# EAGLE schematic zeta2rework_lw_v32_rework (EAGLE 9.3.1)
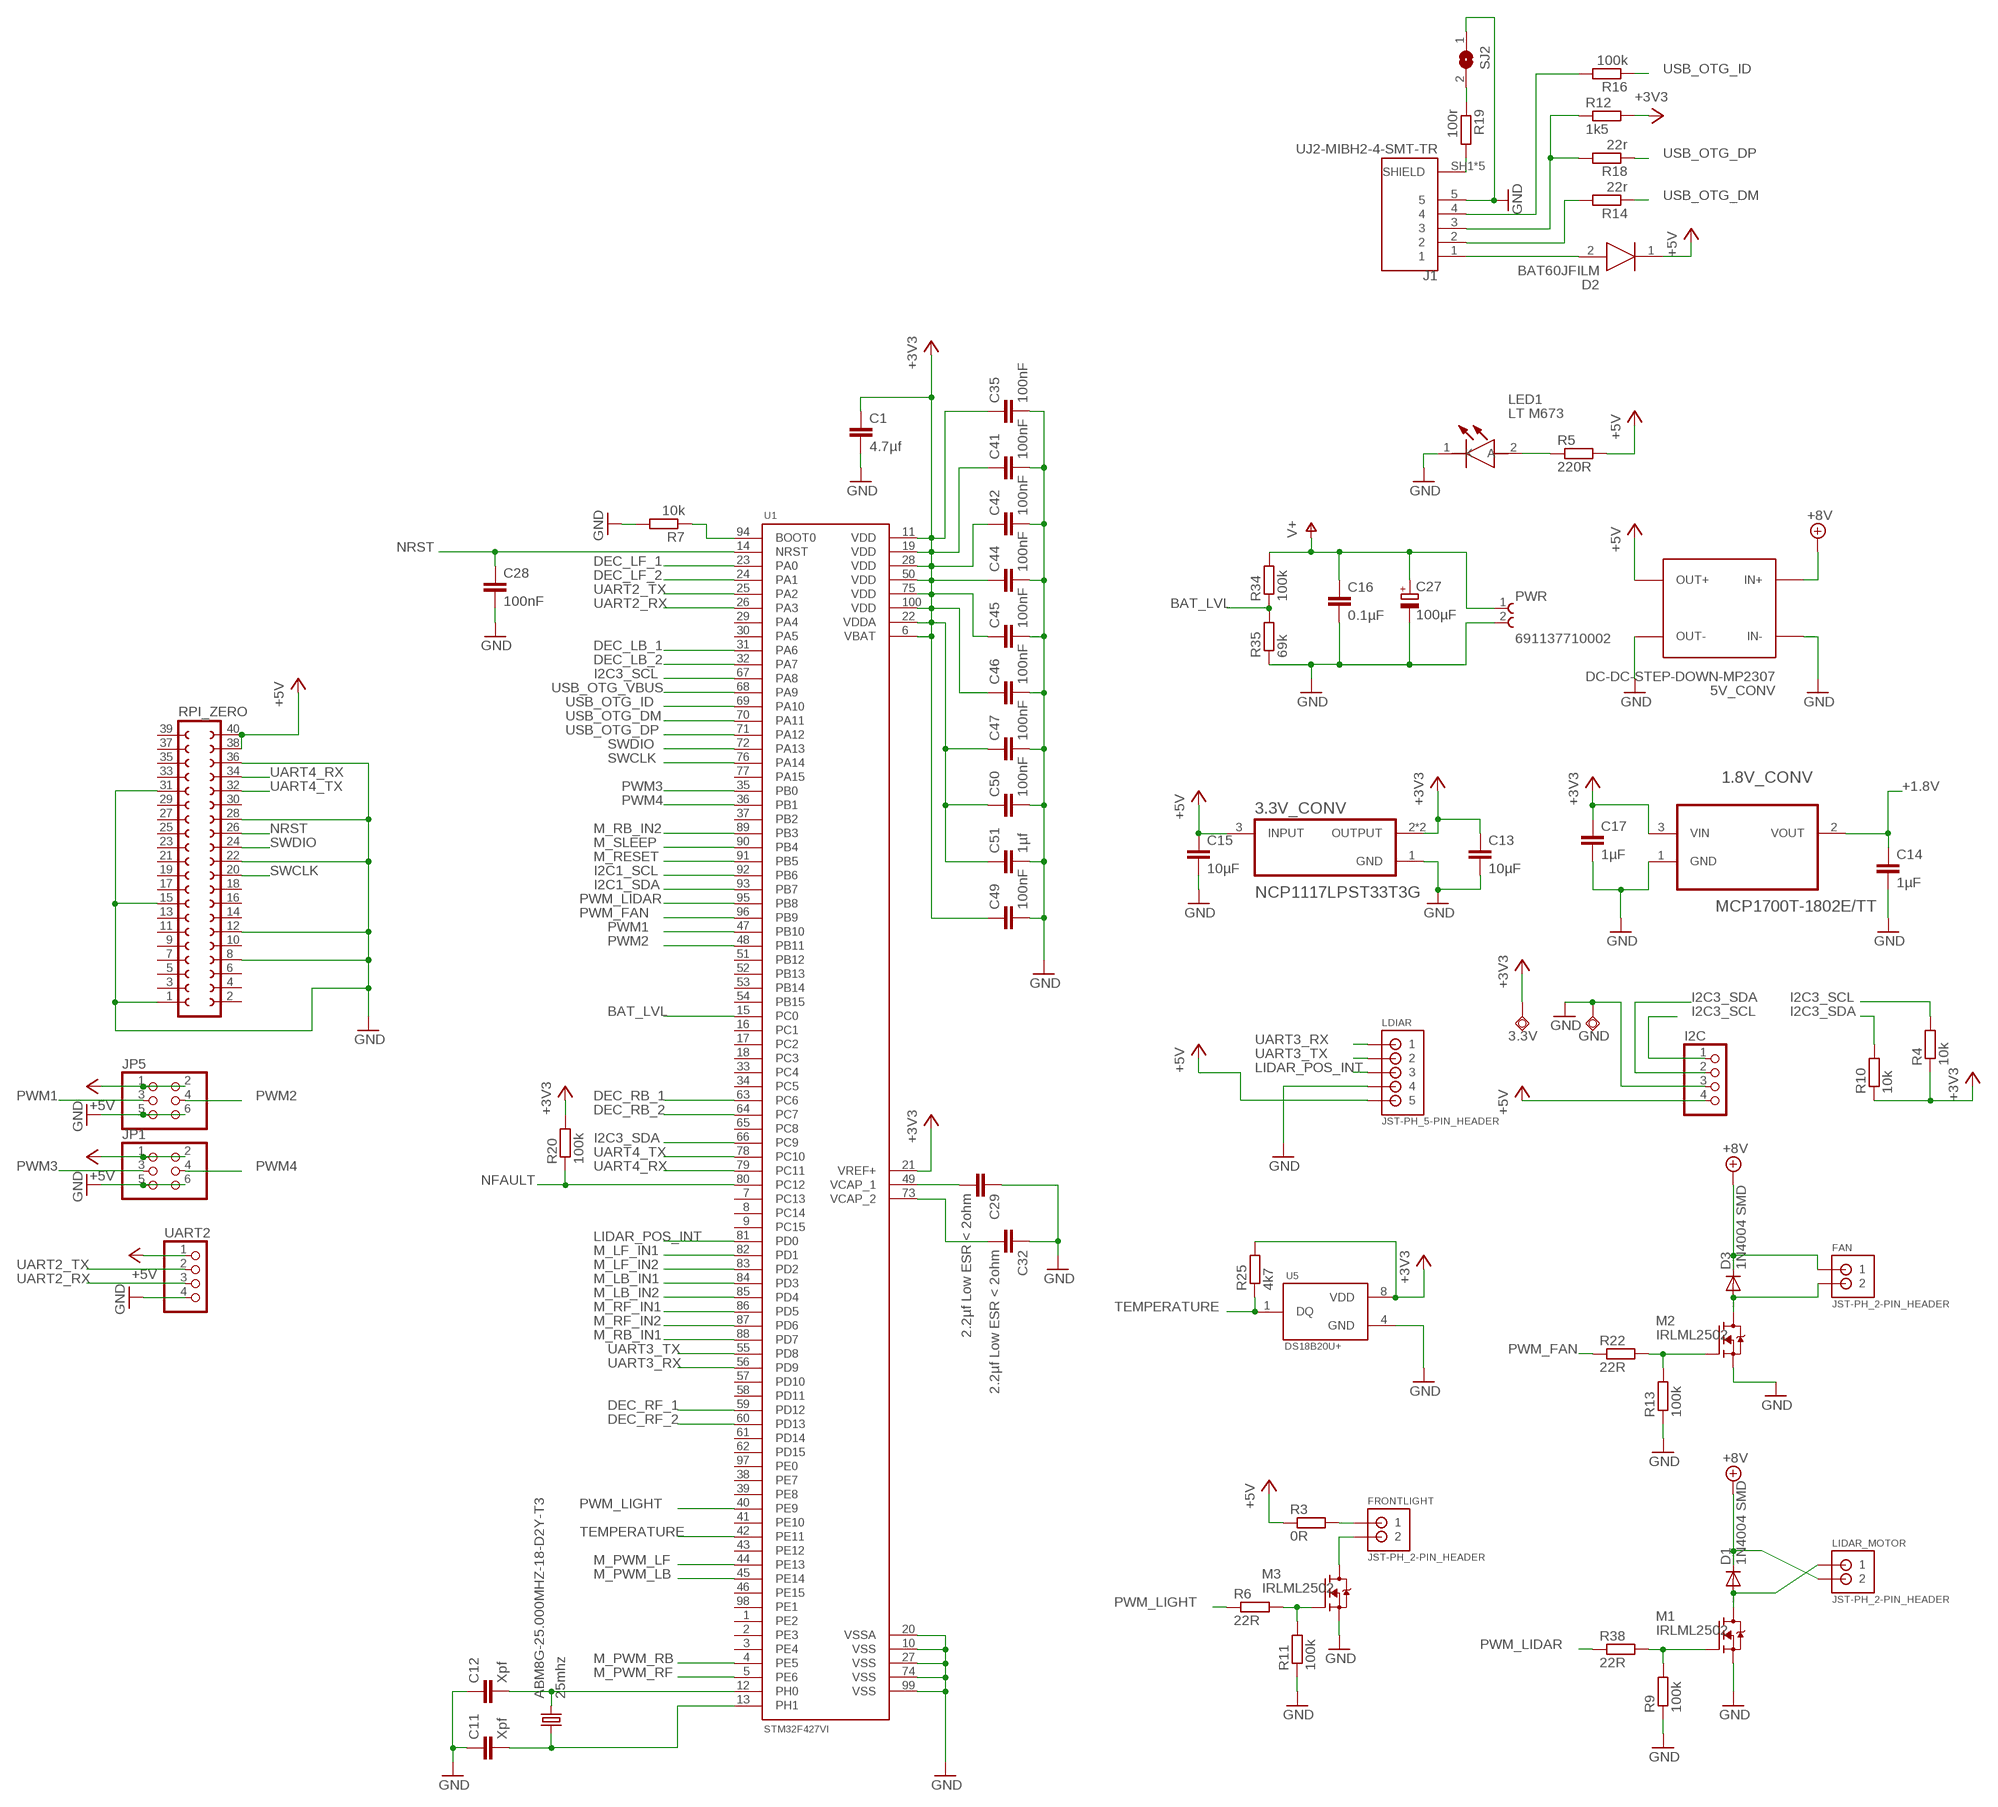
[diagram p0: schematic, sheet 1, part 1 of 2]
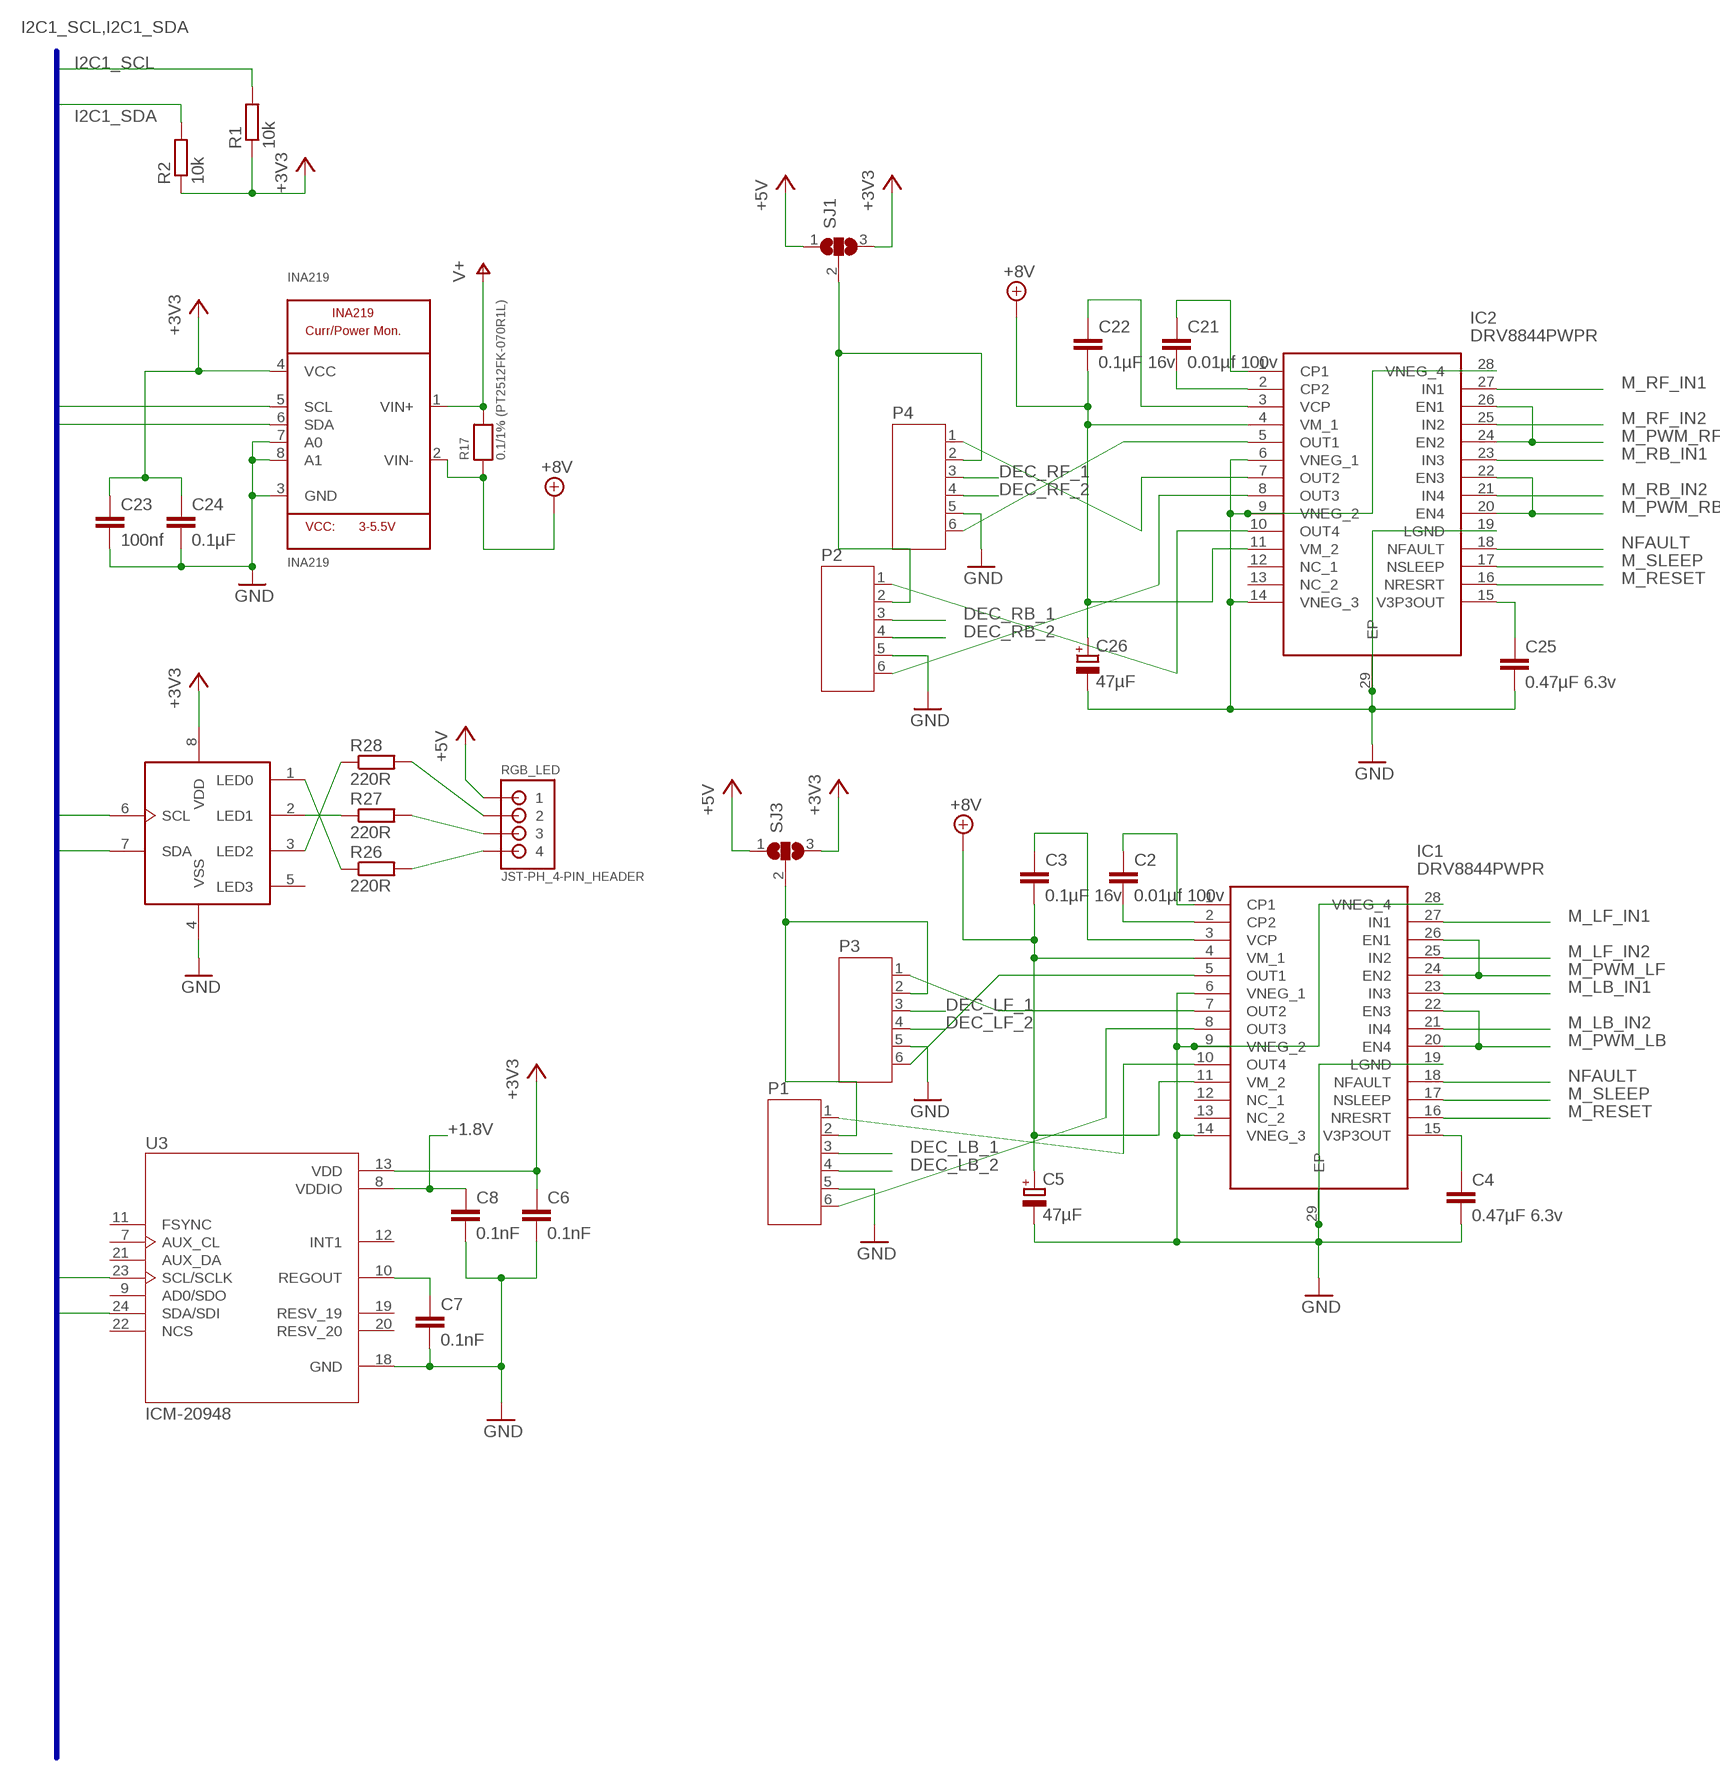
[diagram p1: schematic, sheet 1, part 2 of 2]

## Parts
1.8V_CONV  MCP1700T-1802E/TT  MCP1700T-2102E/TT  [SOT95P237X112-3N]
3.3V  TPSQTP20R  [TP20R]
3.3V_CONV  NCP1117LPST33T3G  [SOT230P700X175-4N]
5V_CONV  DC-DC-STEP-DOWN-MP2307  [DC-DC-STEP-DOWN-MP2307]
ABM8G-25.000MHZ-18-D2Y-T3  25mhz  KX-9A  [5.0X3.2_KX-9A]
C1  4.7µf  C-EUC0603  [C0603]
C2  0.01µf 100v  C-EUC0603  [C0603]
C3  0.1µF 16v  C-EUC0603  [C0603]
C4  0.47µF 6.3v  C-EUC0603  [C0603]
C5  47µF  CPOL-EUUD-5X5,8  [UD-5X5,8_NICHICON]
C6  0.1nF  C-EUC0603  [C0603]
C7  0.1nF  C-EUC0603  [C0603]
C8  0.1nF  C-EUC0603  [C0603]
C11  Xpf  C-EUC0603  [C0603]
C12  Xpf  C-EUC0603  [C0603]
C13  10µF  C-EUC1206  [C1206]
C14  1µF  C-EUC0603  [C0603]
C15  10µF  C-EUC1206  [C1206]
C16  0.1µF  C-EUC0603  [C0603]
C17  1µF  C-EUC0603  [C0603]
C21  0.01µf 100v  C-EUC0603  [C0603]
C22  0.1µF 16v  C-EUC0603  [C0603]
C23  100nf  C-EUC0603  [C0603]
C24  0.1µF  C-EUC0603  [C0603]
C25  0.47µF 6.3v  C-EUC0603  [C0603]
C26  47µF  CPOL-EUUD-5X5,8  [UD-5X5,8_NICHICON]
C27  100µF  CPOL-EUUD-5X5,8  [UD-5X5,8_NICHICON]
C28  100nF  C-EUC0603  [C0603]
C29  2.2µf Low ESR < 2ohm  C-EUC1206  [C1206]
C32  2.2µf Low ESR < 2ohm  C-EUC1206  [C1206]
C35  100nF  C-EUC0603  [C0603]
C41  100nF  C-EUC0603  [C0603]
C42  100nF  C-EUC0603  [C0603]
C44  100nF  C-EUC0603  [C0603]
C45  100nF  C-EUC0603  [C0603]
C46  100nF  C-EUC0603  [C0603]
C47  100nF  C-EUC0603  [C0603]
C49  100nF  C-EUC0603  [C0603]
C50  100nF  C-EUC0603  [C0603]
C51  1µf  C-EUC0603  [C0603]
D1  1N4004 SMD  DIODE-DO214AC  [DO214AC]
D2  BAT60JFILM  [SOD2513X117N]
D3  1N4004 SMD  DIODE-DO214AC  [DO214AC]
FAN  JST-PH_2-PIN_HEADER  [JST_B2B-PH_HEADER]
FRONTLIGHT  JST-PH_2-PIN_HEADER  [JST_B2B-PH_HEADER]
GND  TPSQTP20R  [TP20R]
I2C  PINHD-1X4  [1X04]
IC1  DRV8844PWPR  [SOP65P640X120-29N]
IC2  DRV8844PWPR  [SOP65P640X120-29N]
INA219  INA219  [SOT23-8]
J1  UJ2-MIBH2-4-SMT-TR  [CUI_UJ2-MIBH2-4-SMT-TR]
JP1  PINHD-2X3  [2X03]
JP5  PINHD-2X3  [2X03]
LDIAR  JST-PH_5-PIN_HEADER  [JST_B5B-PH_HEADER]
LED1  LT M673  LT_M673-N1R2-25  [LTM673-N1R2-25]
LIDAR_MOTOR  JST-PH_2-PIN_HEADER  [JST_B2B-PH_HEADER]
M1  IRLML2502  IRLML2502TRPBF  [SOT23]
M2  IRLML2502  IRLML2502TRPBF  [SOT23]
M3  IRLML2502  IRLML2502TRPBF  [SOT23]
P1  JST-PH6  [JST-PH6]
P2  JST-PH6  [JST-PH6]
P3  JST-PH6  [JST-PH6]
P4  JST-PH6  [JST-PH6]
PCA9533  PCA9533  [SOIC8]
PWR  691137710002  [691137710002]
R1  10k  R-EU_R0603  [R0603]
R2  10k  R-EU_R0603  [R0603]
R3  0R  R-EU_R0603  [R0603]
R4  10k  R-EU_R0603  [R0603]
R5  220R  R-EU_R0603  [R0603]
R6  22R  R-EU_R0603  [R0603]
R7  10k  R-EU_R0603  [R0603]
R9  100k  R-EU_R0603  [R0603]
R10  10k  R-EU_R0603  [R0603]
R11  100k  R-EU_R0603  [R0603]
R12  1k5  R-EU_R0603  [R0603]
R13  100k  R-EU_R0603  [R0603]
R14  22r  R-EU_R0603  [R0603]
R16  100k  R-EU_R0603  [R0603]
R17  0.1/1% (PT2512FK-070R1L)  RESISTOR2512  [2512]
R18  22r  R-EU_R0603  [R0603]
R19  100r  R-EU_R0603  [R0603]
R20  100k  R-EU_R0603  [R0603]
R22  22R  R-EU_R0603  [R0603]
R25  4k7  R-EU_R0603  [R0603]
R26  220R  R-EU_R0603  [R0603]
R27  220R  R-EU_R0603  [R0603]
R28  220R  R-EU_R0603  [R0603]
R34  100k  R-EU_R0603  [R0603]
R35  69k  R-EU_R0603  [R0603]
R38  22R  R-EU_R0603  [R0603]
RGB_LED  JST-PH_4-PIN_HEADER  [JST_B4B-PH_HEADER]
RPI_ZERO  FE20-2  [FE20-2]
SJ1  SJ2W  [SJ_2]
SJ2  SJ  [SJ]
SJ3  SJ2W  [SJ_2]
U1  STM32F427VI  STM32F427VGT7  [QFP50P1600X1600X160-100N]
U3  ICM-20948  [QFN40P300X300X105-25N]
U5  DS18B20U+  [SOP65P490X95-8N]
UART2  PINHD-1X4  [1X04]

## Nets
+1.8V: 1.8V_CONV.2(VOUT) C8.1 C14.1 U3.8(VDDIO)
+3V3: 1.8V_CONV.3(VIN) 3.3V.TP 3.3V_CONV.2(OUTPUT) 3.3V_CONV.4(OUTPUT) C1.1 C6.1 C13.1 C17.1 C23.1 C24.1 C35.1 C41.1 C42.1 C44.1 C45.1 C46.1 C47.1 C49.1 C50.1 C51.1 INA219.4(VCC) PCA9533.8(VDD) R1.1 R2.1 R4.1 R10.1 R12.2 R20.2 R25.2 SJ1.3 SJ3.3 U1.6(VBAT) U1.11(VDD) U1.19(VDD) U1.21(VREF+) U1.22(VDDA) U1.28(VDD) U1.50(VDD) U1.75(VDD) U1.100(VDD) U3.13(VDD) U5.8(VDD)
+5V: 3.3V_CONV.3(INPUT) 5V_CONV.OUT+ C15.1 D2.1(K) I2C.4 JP1.1 JP1.2 JP5.1 JP5.2 LDIAR.P5 R3.1 R5.2 RGB_LED.P1 RPI_ZERO.38 RPI_ZERO.40 SJ1.1 SJ3.1 UART2.1
+8V: 5V_CONV.IN+ C3.2 C5.+ C22.2 C26.+ D1.C D3.C FAN.P1 IC1.4(VM_1) IC1.11(VM_2) IC2.4(VM_1) IC2.11(VM_2) INA219.2(VIN-) LIDAR_MOTOR.P2 R17.1
BAT_LVL: R34.1 R35.2 U1.15(PC0)
DEC_LB_1: P1.3 U1.31(PA6)
DEC_LB_2: P1.4 U1.32(PA7)
DEC_LF_1: P3.3 U1.23(PA0)
DEC_LF_2: P3.4 U1.24(PA1)
DEC_RB_1: P2.3 U1.63(PC6)
DEC_RB_2: P2.4 U1.64(PC7)
DEC_RF_1: P4.3 U1.59(PD12)
DEC_RF_2: P4.4 U1.60(PD13)
GND: 1.8V_CONV.1(GND) 3.3V_CONV.1(GND) 5V_CONV.IN- 5V_CONV.OUT- C1.2 C4.2 C5.- C6.2 C7.2 C8.2 C11.1 C12.1 C13.2 C14.2 C15.2 C16.2 C17.2 C23.2 C24.2 C25.2 C26.- C27.- C28.2 C29.1 C32.1 C35.2 C41.2 C42.2 C44.2 C45.2 C46.2 C47.2 C49.2 C50.2 C51.2 GND.TP I2C.3 IC1.6(VNEG_1) IC1.9(VNEG_2) IC1.14(VNEG_3) IC1.19(LGND) IC1.28(VNEG_4) IC1.29(EP) IC2.6(VNEG_1) IC2.9(VNEG_2) IC2.14(VNEG_3) IC2.19(LGND) IC2.28(VNEG_4) IC2.29(EP) INA219.3(GND) INA219.7(A0) INA219.8(A1) J1.5 JP1.5 JP1.6 JP5.5 JP5.6 LDIAR.P4 LED1.1(K) M1.2(S) M2.2(S) M3.2(S) P1.5 P2.5 P3.5 P4.5 PCA9533.4(VSS) PWR.2 R7.2 R9.1 R11.1 R13.1 R35.1 RPI_ZERO.1 RPI_ZERO.8 RPI_ZERO.12 RPI_ZERO.15 RPI_ZERO.22 RPI_ZERO.28 RPI_ZERO.31 RPI_ZERO.36 SJ2.1 U1.10(VSS) U1.20(VSSA) U1.27(VSS) U1.74(VSS) U1.99(VSS) U3.18(GND) U5.4(GND) UART2.4
I2C1_SCL: INA219.5(SCL) PCA9533.6(SCL) R1.2 U1.92(PB6) U3.23(SCL/SCLK)
I2C1_SDA: INA219.6(SDA) PCA9533.7(SDA) R2.2 U1.93(PB7) U3.24(SDA/SDI)
I2C3_SCL: I2C.1 R4.2 U1.67(PA8)
I2C3_SDA: I2C.2 R10.2 U1.66(PC9)
LIDAR_POS_INT: LDIAR.P3 U1.81(PD0)
M_LB_IN1: IC1.23(IN3) U1.84(PD3)
M_LB_IN2: IC1.21(IN4) U1.85(PD4)
M_LF_IN1: IC1.27(IN1) U1.82(PD1)
M_LF_IN2: IC1.25(IN2) U1.83(PD2)
M_PWM_LB: IC1.20(EN4) IC1.22(EN3) U1.45(PE14)
M_PWM_LF: IC1.24(EN2) IC1.26(EN1) U1.44(PE13)
M_PWM_RB: IC2.20(EN4) IC2.22(EN3) U1.4(PE5)
M_PWM_RF: IC2.24(EN2) IC2.26(EN1) U1.5(PE6)
M_RB_IN1: IC2.23(IN3) U1.88(PD7)
M_RB_IN2: IC2.21(IN4) U1.89(PB3)
M_RESET: IC1.16(NRESRT) IC2.16(NRESRT) U1.91(PB5)
M_RF_IN1: IC2.27(IN1) U1.86(PD5)
M_RF_IN2: IC2.25(IN2) U1.87(PD6)
M_SLEEP: IC1.17(NSLEEP) IC2.17(NSLEEP) U1.90(PB4)
N$1: C21.2 IC2.2(CP2)
N$2: C21.1 IC2.1(CP1)
N$3: C22.1 IC2.3(VCP)
N$4: IC2.10(OUT4) P2.1
N$5: J1.3 R12.1 R18.2
N$6: FRONTLIGHT.P1 R3.2
N$7: LED1.2(A) R5.1
N$8: C7.1 U3.10(REGOUT)
N$9: FRONTLIGHT.P2 M3.3(D)
N$10: M3.1(G) R6.2 R11.2
N$11: IC2.5(OUT1) P4.6
N$12: IC2.7(OUT2) P4.1
N$13: ABM8G-25.000MHZ-18-D2Y-T3.1 C11.2 U1.13(PH1)
N$14: IC1.5(OUT1) P3.6
N$15: D2.2(A) J1.1
N$16: R7.1 U1.94(BOOT0)
N$17: J1.4 R16.2
N$18: C2.2 IC1.2(CP2)
N$19: IC2.8(OUT3) P2.6
N$20: C2.1 IC1.1(CP1)
N$21: C3.1 IC1.3(VCP)
N$22: PCA9533.1(LED0) R26.1
N$23: PCA9533.2(LED1) R27.1
N$24: PCA9533.3(LED2) R28.1
N$25: R19.1 SJ2.2
N$26: C25.1 IC2.15(V3P3OUT)
N$27: IC1.7(OUT2) P3.1
N$28: IC1.8(OUT3) P1.6
N$29: C4.1 IC1.15(V3P3OUT)
N$30: IC1.10(OUT4) P1.1
N$31: R26.2 RGB_LED.P4
N$32: P2.2 P4.2 SJ1.2
N$33: R27.2 RGB_LED.P3
N$34: J1.2 R14.2
N$35: R28.2 RGB_LED.P2
N$36: C29.2 U1.49(VCAP_1)
N$37: M2.1(G) R13.2 R22.2
N$38: M1.1(G) R9.2 R38.2
N$39: D1.A LIDAR_MOTOR.P1 M1.3(D)
N$40: J1.SH1(SHIELD) J1.SH2(SHIELD) J1.SH3(SHIELD) J1.SH4(SHIELD) J1.SH5(SHIELD) R19.2
N$41: P1.2 P3.2 SJ3.2
N$44: ABM8G-25.000MHZ-18-D2Y-T3.3 C12.2 U1.12(PH0)
N$45: C32.2 U1.73(VCAP_2)
N$55: D3.A FAN.P2 M2.3(D)
NFAULT: IC1.18(NFAULT) IC2.18(NFAULT) R20.1 U1.80(PC12)
NRST: C28.1 RPI_ZERO.26 U1.14(NRST)
PWM1: JP5.3 U1.47(PB10)
PWM2: JP5.4 U1.48(PB11)
PWM3: JP1.3 U1.35(PB0)
PWM4: JP1.4 U1.36(PB1)
PWM_FAN: R22.1 U1.96(PB9)
PWM_LIDAR: R38.1 U1.95(PB8)
PWM_LIGHT: R6.1 U1.40(PE9)
SWCLK: RPI_ZERO.20 U1.76(PA14)
SWDIO: RPI_ZERO.24 U1.72(PA13)
TEMPERATURE: R25.1 U1.42(PE11) U5.1(DQ)
UART2_RX: U1.26(PA3) UART2.3
UART2_TX: U1.25(PA2) UART2.2
UART3_RX: LDIAR.P1 U1.56(PD9)
UART3_TX: LDIAR.P2 U1.55(PD8)
UART4_RX: RPI_ZERO.34 U1.79(PC11)
UART4_TX: RPI_ZERO.32 U1.78(PC10)
USB_OTG_DM: R14.1 U1.70(PA11)
USB_OTG_DP: R18.1 U1.71(PA12)
USB_OTG_ID: R16.1 U1.69(PA10)
USB_OTG_VBUS: U1.68(PA9)
V+: C16.1 C27.+ INA219.1(VIN+) PWR.1 R17.2 R34.2
Unconnected: IC1.12(NC_1) IC1.13(NC_2) IC2.12(NC_1) IC2.13(NC_2) PCA9533.5(LED3) RPI_ZERO.2 RPI_ZERO.3 RPI_ZERO.4 RPI_ZERO.5 RPI_ZERO.6 RPI_ZERO.7 RPI_ZERO.9 RPI_ZERO.10 RPI_ZERO.11 RPI_ZERO.13 RPI_ZERO.14 RPI_ZERO.16 RPI_ZERO.17 RPI_ZERO.18 RPI_ZERO.19 RPI_ZERO.21 RPI_ZERO.23 RPI_ZERO.25 RPI_ZERO.27 RPI_ZERO.29 RPI_ZERO.30 RPI_ZERO.33 RPI_ZERO.35 RPI_ZERO.37 RPI_ZERO.39 U1.1(PE2) U1.2(PE3) U1.3(PE4) U1.7(PC13) U1.8(PC14) U1.9(PC15) U1.16(PC1) U1.17(PC2) U1.18(PC3) U1.29(PA4) U1.30(PA5) U1.33(PC4) U1.34(PC5) U1.37(PB2) U1.38(PE7) U1.39(PE8) U1.41(PE10) U1.43(PE12) U1.46(PE15) U1.51(PB12) U1.52(PB13) U1.53(PB14) U1.54(PB15) U1.57(PD10) U1.58(PD11) U1.61(PD14) U1.62(PD15) U1.65(PC8) U1.77(PA15) U1.97(PE0) U1.98(PE1) U3.7(AUX_CL) U3.9(AD0/SDO) U3.11(FSYNC) U3.12(INT1) U3.19(RESV_19) U3.20(RESV_20) U3.21(AUX_DA) U3.22(NCS)

## Buses
I2C1_SCL,I2C1_SDA

## Library data of the parts
1.8V_CONV = MCP1700T-2102E_TT:MCP1700T-2102E/TT: Low Quiescent Current LDO; AVAILABILITY: Unavailable; DESCRIPTION: 250mA CMOS LDO, Isupply 1uA and 2% VoutAccuracy; MF: Microchip; MP: MCP1700T-2102E/TT; PACKAGE: SOT-23 Microchip; PRICE: None
3.3V GND = testpad:TPSQ: Test pad
3.3V_CONV = NCP1117LPST33T3G:NCP1117LPST33T3G: None; AVAILABILITY: Unavailable; DESCRIPTION: Linear Voltage Regulator, Positive, LDO, 1.0 A _Fixed and Adjustable_ Vout: 3.3 V; MF: ON Semiconductor; MP: NCP1117LPST33T3G; PACKAGE: SOT-223 ON Semiconductor; PRICE: None
5V_CONV = diy-modules:DC-DC-STEP-DOWN-MP2307: DC/DC Step-Down Regulator based on MP2307DN chip MP2307 datasheet available here: https://cdn-shop.adafruit.com/datasheets/MP2307_r1.9.pdf Click here to find device on ebay.com <http://www.ebay.com/sch/dc+dc+3a+mini+converter>
ABM8G-25.000MHZ-18-D2Y-T3 = crystal-geyer_V1_0:KX: Quartz Crystals (MHz) SMD: KX - Serie Model Size l/w/h [mm] Frequency Range Frequency Stability Temp. Range [°C] Load Capacitance AECQ 200 availabel Datasheet KX-4 KX-5 KX-6 KX-7 KX-9A KX-9B KX-12A KX-12B KX-13 KX-20 KX-K KX-KS 1.6/1.2/0.3 2.0/1.6/0.45 2.5/2.0/0.55 3.2/2.5/0.8 5.0/3.2/1.0 5.0/3.2/1.1 6.0/3.5/1.1 6.0/3.5/1.0 7.0/5.0 /1.3 11.6/5.5/1.6 12.3/4.5/4.2 12.3/4.5/3.2 24.0 ~ 80.0 MHz 16.0 ~ 80.0 MHz 12.0 ~ 80.0 MHz 8.0 ~ 60.0 MHz 7,68 ~ 300,0 MHz 8,0 ~ 50,0 MHz 8,0 ~ 150,0 MHz 8,0 ~ 50,0 MHz 6,0 ~ 160,0 MHz 3,579 ~ 25,0 MHz 3,579 ~ 70,0 MHz 3,579 ~ 70,0 MHz ±10 … ±50ppm ±10 … ±50ppm ±10 … ±50ppm ±10 … ±50ppm ±10 … ±50ppm ±10 … ±50ppm ±10 … ±50ppm ±10 … ±50ppm ±10 … ±50ppm ±50ppm ±10 … ±50ppm ±10 … ±50ppm (*) -40°C …+85°C (*) -40°C …+125°C (*) -40°C …+125°C (*) -40°C …+125°C (*) -40°C …+105°C (*) -40°C …+105°C (*) -40°C …+125°C (*) -40°C …+105°C (*) -40°C …+105°C (*) -40°C …+105°C (*) -40°C …+85°C (*) -40°C …+85°C 8, 8…16 8, 8…16 10, 8…16 12, 7…20 16, 10…20 16, 10…20 16, 10…20 16, 12…20 16, 12…20 16, 12…20 16, 12…30 16, 12…30 - yes yes yes - - - - - - - - KX-4.pdf <http://www.geyer-electronic.de/uploads/tx_userartikelfrequenz/GEYER-KX-4.pdf> KX-5.pdf <http://www.geyer-electronic.de/uploads/tx_userartikelfrequenz/GEYER-KX-5.pdf> KX-6.pdf <http://www.geyer-electronic.de/uploads/tx_userartikelfrequenz/GEYER-KX-6.pdf> KX-7.pdf <http://www.geyer-electronic.de/uploads/tx_userartikelfrequenz/GEYER-KX-7.pdf> KX-9A.pdf <http://www.geyer-electronic.de/uploads/tx_userartikelfrequenz/GEYER-KX-9A.pdf> KX-9B.pdf <http://www.geyer-electronic.de/uploads/tx_userartikelfrequenz/GEYER-KX-9B.pdf> KX-12A.pdf <http://www.geyer-electronic.de/uploads/tx_userartikelfrequenz/GEYER-KX-12A.pdf> KX-12B.pdf <http://www.geyer-electronic.de/uploads/tx_userartikelfrequenz/GEYER-KX-12B.pdf> KX-13.pdf <http://www.geyer-electronic.de/uploads/tx_userartikelfrequenz/GEYER-KX-13.pdf> KX-20.pdf <http://www.geyer-electronic.de/uploads/tx_userartikelfrequenz/GEYER-KX-20.pdf> KX-K.pdf <http://www.geyer-electronic.de/uploads/tx_userartikelfrequenz/GEYER-KX-K.pdf> KX-KS.pdf <http://www.geyer-electronic.de/uploads/tx_userartikelfrequenz/GEYER-KX-KS.pdf> <http://www.geyer-electronic.de/fileadmin/template/img/logo-geyer-electronic.png> Details see: http://www.geyer-electronic.de/Frequenz-Produkte.9.0.html Created 2016-06-07, Hans Locher 2016 (C) Geyer Quartz Technology KX4,KX5,KX6,KX7,KX9A,KX9B,KX12A,KX12B,KX13,KX20,KXK,KXKS;1612;2016;2520;3225;5032;6035;7050;11655;12345;1,6x1,2;2,0x1,6;2,5x2,0;3,2x2,5;5,0x3,2;6,0x3,5;7,0x5,0;11,6x5,5;12,3x4,5;12,3x4,5;1.6x1.2;2.0x1.6;2.5x2.0;3.2x2.5;5.0x3.2;6.0x3.5;7.0x5.0;11.6x5.5;12.3x4.5;12.3x4.5;
C1-C4 C6-C8 C11-C17 C21-C25 C28 C29 C32 C35 C41 C42 C44-C47 C49-C51 = rcl:C-EU: CAPACITOR, European symbol; SPICEPREFIX: C
C5 C26 C27 = rcl:CPOL-EU: POLARIZED CAPACITOR, European symbol; SPICEPREFIX: C
D1 D3 = diode:DIODE-: DIODE
D2 = BAT60JFILM:BAT60JFILM: BAT60JFILM, Schottky Diode, 3A max, 10V, 2-Pin, SOD-323 Source: Datasheet <http://www.st.com/web/en/resource/technical/document/datasheet/CD00001944.pdf>; ALLIED_NUMBER: 70389806; ALLIED_PRICE-STOCK: http://www.alliedelec.com/stmicroelectronics-bat60jfilm/70389806/; DESCRIPTION: BAT60JFILM, Schottky Diode, 3A max, 10V, 2-Pin, SOD-323; HEIGHT: 1.17mm; MANUFACTURER_NAME: STMicroelectronics; MANUFACTURER_PART_NUMBER: BAT60JFILM; MOUSER_PART_NUMBER: 511-BAT60JFILM; MOUSER_PRICE-STOCK: https://www.mouser.com/Search/Refine.aspx?Keyword=511-BAT60JFILM; RS_PART_NUMBER: 1458781; RS_PRICE-STOCK: http://uk.rs-online.com/web/p/products/1458781
FAN FRONTLIGHT LIDAR_MOTOR = srg:JST-PH_2-PIN_HEADER: 2-pin JST PH Shrouded Header, top entry P/N B2B-PH-K-S Mating connector PHR-2 Mating cable assembly: Sparkfun PRT-09914 <http://www.sparkfun.com/products/9914>
I2C UART2 = pinhead:PINHD-1X4: PIN HEADER
IC1 IC2 = DRV8844PWPR:DRV8844PWPR: 5A Brushed DC motor or Quad 1.75A Solenoid/Relay Driver with +/-30V split supply support (PWM Ctrl) Source: Datasheet <http://www.ti.com/lit/ds/symlink/drv8844.pdf>; DESCRIPTION: 5A Brushed DC motor or Quad 1.75A Solenoid/Relay Driver with +/-30V split supply support (PWM Ctrl); HEIGHT: 1.2mm; MANUFACTURER_NAME: Texas Instruments; MANUFACTURER_PART_NUMBER: DRV8844PWPR; MOUSER_PART_NUMBER: 595-DRV8844PWPR; MOUSER_PRICE-STOCK: https://www.mouser.com/Search/Refine.aspx?Keyword=595-DRV8844PWPR
INA219 = INA219:INA219: INA219 - I2C Current/Power Monitor Voltage Range: 0-26V Accuracy: 0.5% Temperature: -40°C - 125°C; AVAILABILITY: Unavailable; DESCRIPTION: the ina219 is a high-side current shunt and power monitor with an i2c interface. the ina219 monitors both shunt drop ...; MF: Texas Instruments; MP: INA219; PACKAGE: None; PRICE: None
J1 = UJ2-MIBH2-4-SMT-TR:UJ2-MIBH2-4-SMT-TR: Micro B Type 5 Pin Horizontal 30 µin Plating SMT USB Jack 2.0; AVAILABILITY: Unavailable; CUI_PURCHASE_URL: https://www.cui.com/product/interconnect/usb-connectors/micro-b/uj2-mibh2-4-smt?utm_source=snapeda.com&utm_medium=referral&utm_campaign=snapedaBOM; DESCRIPTION: Micro B Type 5 Pin Horizontal 30 µin Plating SMT USB Jack 2.0; MF: CUI Inc.; MP: UJ2-MIBH2-4-SMT-TR; PACKAGE: None; PRICE: None
JP1 JP5 = pinhead:PINHD-2X3: PIN HEADER
LDIAR = srg:JST-PH_5-PIN_HEADER: 5-pin JST PH Shrouded Header, top entry P/N B5B-PH-K-S Mating connector PHR-5 Mating cable assembly: Sparkfun PRT-09917 <http://www.sparkfun.com/products/9917>
LED1 = LT_M673-N1R2-25:LT_M673-N1R2-25: Osram Opto LT M673-N1R2-25, Mini TOPLED Series Green LED, 529 nm,, Rectangle Lens SMD Package Source: Datasheet <https://www.osram-os.com/Graphics/XPic0/00252812_0.pdf/LT M673.pdf>; DESCRIPTION: Osram Opto LT M673-N1R2-25, Mini TOPLED Series Green LED, 529 nm,, Rectangle Lens SMD Package; HEIGHT: mm; MANUFACTURER_NAME: OSRAM Opto Semiconductors; MANUFACTURER_PART_NUMBER: LT M673-N1R2-25; MOUSER_PART_NUMBER: 720-LTM673N1R225Z; MOUSER_PRICE-STOCK: https://www.mouser.com/Search/Refine.aspx?Keyword=720-LTM673N1R225Z; RS_PART_NUMBER: 9133231; RS_PRICE-STOCK: http://uk.rs-online.com/web/p/products/9133231
M1-M3 = IRLML2502TRPBF:IRLML2502TRPBF; AVAILABILITY: Unavailable; DESCRIPTION: Single N-Channel 20 V 0.08 Ohm 12 nC 1.25 W Silicon SMT Mosfet - SOT-23; MF: Infineon; MP: IRLML2502TRPBF; PACKAGE: SOT-23-3 Infineon; PRICE: None
P1-P4 = jst-ph:JST-PH6
PCA9533 = adam - ics:PCA9533: PCA9533D/01: LED driver and dimmer 4 channel, PWM @ 8 bit resolution 25mA / channel sink external resistors per LED I2C protocol @ 400kHz (fast) digikey: 568-3372-5-ND, 8-SOIC, $1.92
PWR = term block:691137710002: SERIE 1377 - 5.00 MM - HORIZONTAL CABLE ENTRY WITH PRESSURE CLAMP - GLOW WIRE PLASTIC - WR-TBL <http://katalog.we-online.de/media/images/v2/Family_WR-TBL1_6911377100xx.jpg> Details see: http://katalog.we-online.de/en/em/TBL_5_00_1377_HORIZONTAL_ENTRY_W_PRESSURE_CLAMP_GLOW_WIRE_6911377100xx Created by Yingchun,Shan 2016(C) Wurth Elektronik; AVAILABILITY: Unavailable; DESCRIPTION: Term Block 2pos Side Entry 5mm; MF: Wurth Electronics; MP: 691137710002; PACKAGE: None; PRICE: None
R1-R7 R9-R14 R16 R18-R20 R22 R25-R28 R34 R35 R38 = rcl:R-EU_: RESISTOR, European symbol; SPICEPREFIX: R
R17 = microbuilder:RESISTOR: Resistors 0402 - 0402 Surface Mount Package 22 Ohm 1% 1/16W [Digikey: 311-22.0LRTR-ND] 33 Ohm 5% 1/16W 1.0K 5% 1/16W 1.5K 5% 1/16W 2.0K 1% 1/16W 10.0K 1% 1/16W [Digikey: 311-10.0KLRTR-ND] 10.0K 5% 1/16W [Digikey: RMCF0402JT10K0TR-ND] 12.1K 1% 1/16W [Digikey: 311-22.0LRTR-ND] 100.0K 5% 1/16W 0603 - 0603 Surface Mount Package 0 Ohm 1/10 Watt 1% Resistor 15 Ohm 1/10 Watt 1% Resistor 33 Ohm 1/10 Watt 1% Resistor 49.9 Ohm 1/10 Watt 1% Resistor 100 Ohm 1/10 Watt 1% Resistor 150 Ohm 1/10 Watt 1% Resistor 240 Ohm 1/10 Watt 1% Resistor 390 Ohm 1/10 Watt 1% Resistor 560 Ohm 1/10 Watt 1% Resistor 680 Ohm 1/10 Watt 1% Resistor 750 Ohm 1/10 Watt 1% Resistor 1.0K Ohm 1/10 Watt 1% Resistor 1.5K Ohm 1/10 Watt 1% Resistor 2.0K Ohm 1/10 Watt 1% Resistor 2.2K Ohm 1/10 Watt 1% Resistor 3.3K Ohm 1/10 Watt 1% Resistor 4.7K Ohm 1/10 Watt 1% Resistor 10.0K Ohm 1/10 Watt 1% Resistor 12.0K Ohm 1/10 Watt 1% Resistor 12.1K Ohm 1/10 Watt 1% Resistor 20.0K Ohm 1/10 Watt 1% Resistor 33.0K Ohm 1/10 Watt 1% Resistor 100.0K Ohm 1/10 Watt 1% Resistor 0805 - 0805 Surface Mount Package 0 Ohm 1/8 Watt 1% Resistor 33 Ohm 1/8 Watt 1% Resistor 100 Ohm 1/8 Watt 1% Resistor 150 Ohm 1/8 Watt 1% Resistor 200 Ohm 1/8 Watt 1% Resistor 240 Ohm 1/8 Watt 1% Resistor 330 Ohm 1/8 Watt 1% Resistor 390 Ohm 1/8 Watt 1% Resistor 470 Ohm 1/8 Watt 1% Resistor 1.0K Ohm 1/8 Watt 1% Resistor 1.5K Ohm 1/8 Watt 1% Resistor 2.0K Ohm 1/8 Watt 1% Resistor 4.7K Ohm 1/8 Watt 1% Resistor 5.1K Ohm 1/8 Watt 1% Resistor 5.6K Ohm 1/8 Watt 1% Resistor 10.0K Ohm 1/8 Watt 1% Resistor 22.0K Ohm 1/8 Watt 1% Resistor 33.0K Ohm 1/8 Watt 1% Resistor 100K Ohm 1/8 Watt 1% Resistor 1206 - 1206 Surface Mount Package 2012 - 2010 Surface Mount Package 0.11 Ohm 1/2 Watt 1% Resistor - Digikey: RHM.11UCT-ND
RGB_LED = srg:JST-PH_4-PIN_HEADER: 4-pin JST PH Shrouded Header, top entry P/N B4B-PH-K-S Mating connector PHR-4 Mating cable assembly: Sparkfun PRT-09916 <http://www.sparkfun.com/products/9916>
RPI_ZERO = con-lsta:FE20-2: FEMALE HEADER; OC_FARNELL: unknown; OC_NEWARK: unknown
SJ1 SJ3 = jumper:SJ2W: SMD solder JUMPER
SJ2 = jumper:SJ: SMD solder JUMPER
U1 = STM32F427VGT7:STM32F427VGT7: MCU 32-bit STM32F ARM Cortex M4 RISC 1024KB Flash 2.5V/3.3V 100-Pin LQFP Tray; AVAILABILITY: Unavailable; DESCRIPTION: Ic Mcu 32bit 1mb Flash 100lqfp; MF: STMicroelectronics; MP: STM32F427VGT7; PACKAGE: LQFP-100 STMicroelectronics; PRICE: None
U3 = ICM-20948:ICM-20948: Axis=3 Axis Gyro+3 Axis Accel+Compass. Pin For Pin With m; AVAILABILITY: Unavailable; DESCRIPTION: 9 Axis=3 Axis Gyro+3 Axis Accel+Compass. Pin For Pin With m; MF: TDK InvenSense; MP: ICM-20948; PACKAGE: QFN-24 InvenSense; PRICE: None
U5 = DS18B20U_:DS18B20U+: Board Mount Temperature Sensors Prgmble Resolution 1-Wire Parasite Pwr; AVAILABILITY: Unavailable; DESCRIPTION: Date Code: 1043+; RoHS Compliant: Yes;; MF: Maxim; MP: DS18B20U+; PACKAGE: TSSOP-8 Chip Coolers; PRICE: None

## Net classes
0 default: clearance 0.203 mm